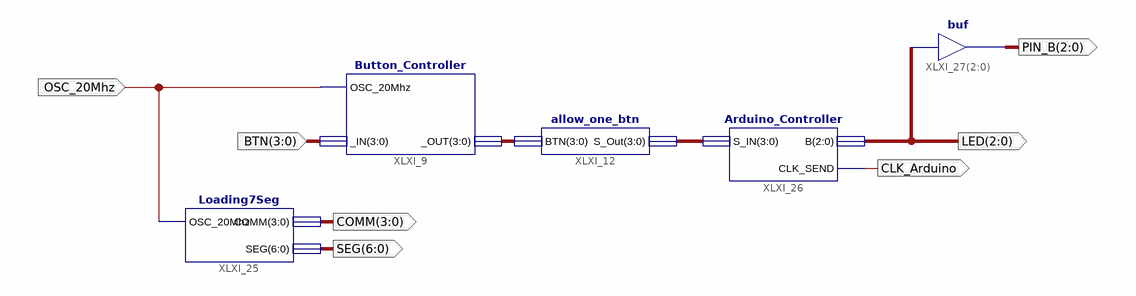
[diagram p0: schematic sheet 1]
// Xilinx ISE schematic Main.sch (spartan6) as structural Verilog: 5 symbols, 7 ports
module Main (
  input  OSC_20Mhz,
  input  [3:0] BTN,
  output [2:0] LED,
  output CLK_Arduino,
  output [3:0] COMM,
  output [6:0] SEG,
  output [2:0] PIN_B
);

  wire [3:0] XLXN_3, XLXN_4;

  Button_Controller XLXI_9 (.OSC_20Mhz(OSC_20Mhz), ._IN(BTN), ._OUT(XLXN_3));
  allow_one_btn XLXI_12 (.BTN(XLXN_3), .S_Out(XLXN_4));
  Loading7Seg XLXI_25 (.OSC_20Mhz(OSC_20Mhz), .COMM(COMM), .SEG(SEG));
  Arduino_Controller XLXI_26 (.S_IN(XLXN_4), .B(LED), .CLK_SEND(CLK_Arduino));
  assign PIN_B = LED;  // buf XLXI_27[2..0], 3 bits wide
endmodule
